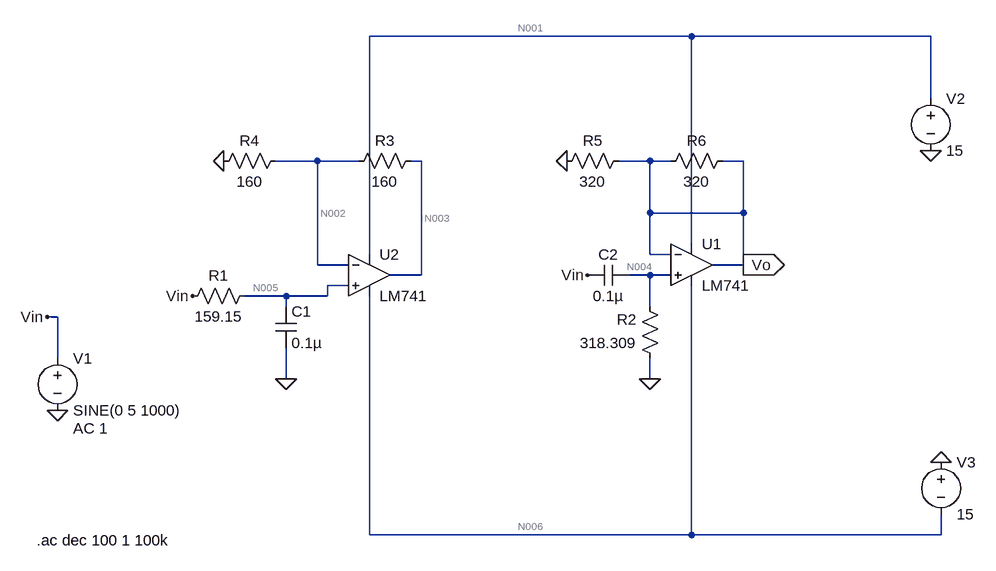
[diagram p0: schematic Active_Filters.asc]
Active_Filters.asc, the LTspice schematic file:
Version 4
SHEET 1 1336 680
WIRE 896 -304 400 -304
WIRE 1264 -304 896 -304
WIRE 1264 -208 1264 -304
WIRE 320 -112 256 -112
WIRE 384 -112 320 -112
WIRE 480 -112 464 -112
WIRE 832 -112 784 -112
WIRE 864 -112 832 -112
WIRE 976 -112 944 -112
WIRE 832 -32 832 -112
WIRE 976 -32 976 -112
WIRE 976 -32 832 -32
WIRE 896 16 896 -304
WIRE 400 32 400 -304
WIRE 832 32 832 -32
WIRE 864 32 832 32
WIRE 320 48 320 -112
WIRE 368 48 320 48
WIRE 976 48 976 -32
WIRE 976 48 928 48
WIRE 480 64 480 -112
WIRE 480 64 432 64
WIRE 832 64 800 64
WIRE 864 64 832 64
WIRE 368 80 336 80
WIRE 272 96 208 96
WIRE 336 96 336 80
WIRE 336 96 272 96
WIRE 272 112 272 96
WIRE 832 112 832 64
WIRE -80 128 -96 128
WIRE -80 192 -80 128
WIRE 272 224 272 176
WIRE 832 224 832 192
WIRE 400 464 400 96
WIRE 896 464 896 80
WIRE 896 464 400 464
WIRE 1280 464 1280 432
WIRE 1280 464 896 464
FLAG -80 272 0
FLAG 272 224 0
FLAG 832 224 0
FLAG 976 48 Vo
IOPIN 976 48 Out
FLAG 1264 -128 0
FLAG 1280 352 0
FLAG 176 -112 0
FLAG 704 -112 0
FLAG -96 128 Vin
FLAG 736 64 Vin
FLAG 128 96 Vin
SYMBOL voltage -80 176 R0
WINDOW 123 24 124 Left 2
WINDOW 39 0 0 Left 0
SYMATTR Value2 AC 1
SYMATTR InstName V1
SYMATTR Value SINE(0 5 1000)
SYMBOL voltage 1264 -224 R0
SYMATTR InstName V2
SYMATTR Value 15
SYMBOL voltage 1280 336 R0
SYMATTR InstName V3
SYMATTR Value 15
SYMBOL OpAmps\\LM741 896 -16 R0
SYMATTR InstName U1
SYMBOL OpAmps\\LM741 400 0 R0
SYMATTR InstName U2
SYMBOL cap 256 112 R0
SYMATTR InstName C1
SYMATTR Value 0.1µ
SYMBOL cap 800 48 R90
WINDOW 0 0 32 VBottom 2
WINDOW 3 32 32 VTop 2
SYMATTR InstName C2
SYMATTR Value 0.1µ
SYMBOL res 224 80 R90
WINDOW 0 0 56 VBottom 2
WINDOW 3 32 56 VTop 2
SYMATTR InstName R1
SYMATTR Value 159.15
SYMATTR SpiceLine tol=0
SYMBOL res 848 208 R180
WINDOW 0 36 76 Left 2
WINDOW 3 36 40 Left 2
SYMATTR InstName R2
SYMATTR Value 318.309
SYMATTR SpiceLine tol=0
SYMBOL res 480 -128 R90
WINDOW 0 0 56 VBottom 2
WINDOW 3 32 56 VTop 2
SYMATTR InstName R3
SYMATTR Value 160
SYMBOL res 272 -128 R90
WINDOW 0 0 56 VBottom 2
WINDOW 3 32 56 VTop 2
SYMATTR InstName R4
SYMATTR Value 160
SYMBOL res 800 -128 R90
WINDOW 0 0 56 VBottom 2
WINDOW 3 32 56 VTop 2
SYMATTR InstName R5
SYMATTR Value 320
SYMBOL res 960 -128 R90
WINDOW 0 0 56 VBottom 2
WINDOW 3 32 56 VTop 2
SYMATTR InstName R6
SYMATTR Value 320
TEXT -112 472 Left 2 !.ac dec 100 1 100k

The netlist it stands for:
* Active_Filters.asc
V1 Vin 0 SINE(0 5 1000) AC 1
V2 N001 0 15
V3 0 N006 15
XU1 N004 Vo N001 N006 Vo LM741  ; pins In+ In- V+ V- OUT
XU2 N005 N002 N001 N006 N003 LM741  ; pins In+ In- V+ V- OUT
C1 N005 0 0.1µ
C2 N004 Vin 0.1µ
R1 N005 Vin 159.15 tol=0
R2 0 N004 318.309 tol=0
R3 N003 N002 160
R4 N002 0 160
R5 Vo 0 320
R6 Vo Vo 320
.ac dec 100 1 100k
.lib LM741.lib
.backanno
.end

* Results of the author's LTspice run, read from the files saved beside the schematic
* Operating Point, zero values left out:
*   V(n001) = 15 V
*   V(n006) = -15 V
*   V(vo) = 981.6 µV
*   V(n004) = -18.42 µV
*   V(n002) = 990.8 µV
*   V(n005) = -9.208 µV
*   V(n003) = 1.998 mV
*   I(R5) = 3.067 µA
*   I(R4) = 6.192 µA
*   I(R3) = 6.294 µA
*   I(R2) = 57.86 nA
*   I(R1) = -57.86 nA
*   I(V3) = -3.398 mA
*   I(V2) = -3.407 mA
*   I(V1) = -57.86 nA
*   Ix(u1:1) = 57.86 nA
*   Ix(u1:2) = 101.9 nA
*   Ix(u1:99) = 1.703 mA
*   Ix(u1:50) = -1.7 mA
*   Ix(u1:28) = -3.169 µA
*   Ix(u2:1) = 57.86 nA
*   Ix(u2:2) = 101.9 nA
*   Ix(u2:99) = 1.704 mA
*   Ix(u2:50) = -1.698 mA
*   Ix(u2:28) = -6.294 µA
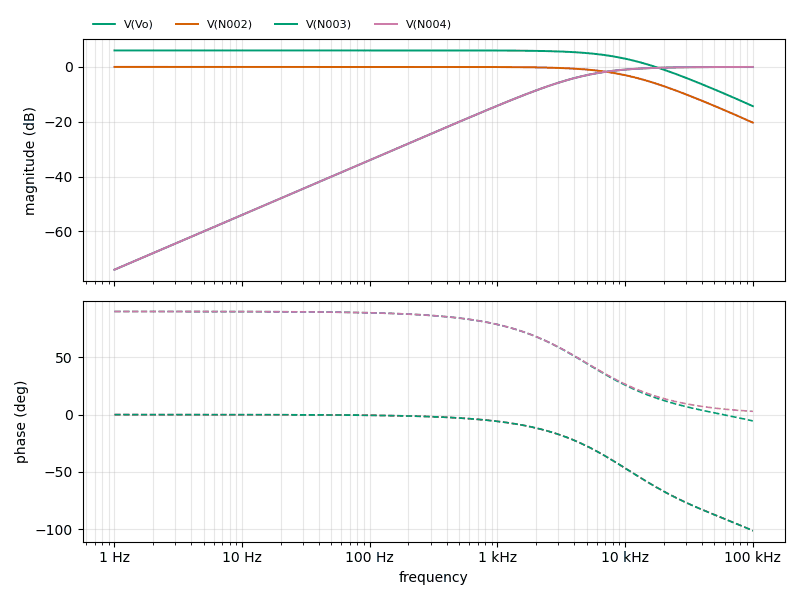
[diagram p1: AC Analysis of Active_Filters.asc, plotted from the saved traces]
* AC Analysis, 1 run:
*   V(Vo): -73.98 dB at 1 Hz, -0.05 dB at 100 kHz, peak -0.04 dB at 70.79 kHz, 3 dB below the peak at 4.952 kHz
*   V(N002): 0.00 dB at 1 Hz, -20.33 dB at 100 kHz, peak 0.00 dB at 1 Hz, 3 dB below the peak at 9.993 kHz
*   V(N003): 6.02 dB at 1 Hz, -14.31 dB at 100 kHz, peak 6.02 dB at 1 Hz, 3 dB below the peak at 9.993 kHz
*   V(N004): -73.98 dB at 1 Hz, -0.01 dB at 100 kHz, peak -0.01 dB at 100 kHz, 3 dB below the peak at 4.988 kHz